# EAGLE design Temperature_GUN (EAGLE 7.7.0)

## Sheet 1 of 2
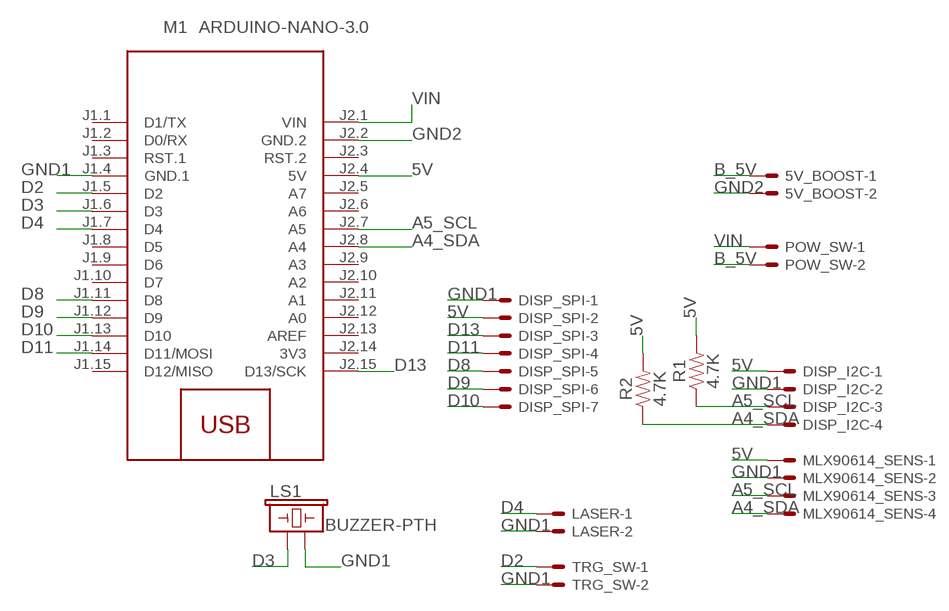
[diagram p0: schematic, sheet 1]

### Parts
5V_BOOST  JST-XH-02-PIN-ROUND-PAD  [JST-XH-02-PACKAGE-ROUND-PAD]
DISP_I2C  JST-XH-04-PIN-ROUND-PAD  [JST-XH-04-PACKAGE-ROUND-PAD]
DISP_SPI  JST-XH-07-PIN-ROUND-PAD  [JST-XH-07-PACKAGE-ROUND-PAD]
LASER  JST-XH-02-PIN-ROUND-PAD  [JST-XH-02-PACKAGE-ROUND-PAD]
LS1  BUZZER-PTH  [BUZZER-12MM]
M1  ARDUINO-NANO-3.0  [ARDUINO-NANO-3.0]
MLX90614_SENS  JST-XH-04-PIN-ROUND-PAD  [JST-XH-04-PACKAGE-ROUND-PAD]
POW_SW  JST-XH-02-PIN-ROUND-PAD  [JST-XH-02-PACKAGE-ROUND-PAD]
R1  4.7K  1KOHM-HORIZ-1/4W-1%  [AXIAL-0.3]
R2  4.7K  1KOHM-HORIZ-1/4W-1%  [AXIAL-0.3]
TRG_SW  JST-XH-02-PIN-ROUND-PAD  [JST-XH-02-PACKAGE-ROUND-PAD]

### Nets
5V: DISP_I2C.1 DISP_SPI.2 M1.J2.4(5V) MLX90614_SENS.1 R1.P$2 R2.P$2
A4_SDA: DISP_I2C.4 M1.J2.8(A4) MLX90614_SENS.4 R2.P$1
A5_SCL: DISP_I2C.3 M1.J2.7(A5) MLX90614_SENS.3 R1.P$1
B_5V: 5V_BOOST.1 POW_SW.2
D2: M1.J1.5(D2) TRG_SW.1
D3: LS1.+ M1.J1.6(D3)
D4: LASER.1 M1.J1.7(D4)
D8: DISP_SPI.5 M1.J1.11(D8)
D9: DISP_SPI.6 M1.J1.12(D9)
D10: DISP_SPI.7 M1.J1.13(D10)
D11: DISP_SPI.4 M1.J1.14(D11/MOSI)
D13: DISP_SPI.3 M1.J2.15(D13/SCK)
GND1: DISP_I2C.2 DISP_SPI.1 LASER.2 LS1.- M1.J1.4(GND.1) MLX90614_SENS.2 TRG_SW.2
GND2: 5V_BOOST.2 M1.J2.2(GND.2)
VIN: M1.J2.1(VIN) POW_SW.1
Unconnected: M1.J1.1(D1/TX) M1.J1.2(D0/RX) M1.J1.3(RST.1) M1.J1.8(D5) M1.J1.9(D6) M1.J1.10(D7) M1.J1.15(D12/MISO) M1.J2.3(RST.2) M1.J2.5(A7) M1.J2.6(A6) M1.J2.9(A3) M1.J2.10(A2) M1.J2.11(A1) M1.J2.12(A0) M1.J2.13(AREF)

## Sheet 2 of 2

## Power pins joined to a net without a drawn wire
3V3: M1.J2.14(3V3)

## Library data of the parts
5V_BOOST LASER POW_SW TRG_SW = Rembrandt Electronics - JST XH Connectors v1-0:JST-XH-02-PIN: JST XH Connector 2 Pin Wire to board connector. Pitch: 2,54 mm, (0.100") Number of pins: 2 Created by Rembrandt Electronics www.rembrandtelectronics.com
DISP_I2C MLX90614_SENS = Rembrandt Electronics - JST XH Connectors v1-0:JST-XH-04-PIN: JST XH Connector 2 Pin Wire to board connector. Pitch: 2,54 mm, (0.100") Number of pins: 4 Created by Rembrandt Electronics www.rembrandtelectronics.com
DISP_SPI = Rembrandt Electronics - JST XH Connectors v1-0:JST-XH-07-PIN: JST XH Connector 2 Pin Wire to board connector. Pitch: 2,54 mm, (0.100") Number of pins: 7 Created by Rembrandt Electronics www.rembrandtelectronics.com
LS1 = SparkFun-Electromechanical:BUZZER: Buzzer Small round buzzers that operate around the audible 2kHz range. You can use these as speakers to create simple music or user interfaces. Variant Overview: PTH - Mini Speaker - PC Mount 12mm 2.048kHz <https://www.sparkfun.com/products/7950> PTH_KIT - Mini Speaker - PC Mount 12mm 2.048kHz <https://www.sparkfun.com/products/7950> KIT simplifies soldering by adding stop mask to one side of the pads. PTH_NO_SILK - Mini Speaker - PC Mount 12mm 2.048kHz <https://www.sparkfun.com/products/7950> No silkscreen indicator of buzzer outline. PTH_KIT_NO_SILK - Mini Speaker - PC Mount 12mm 2.048kHz <https://www.sparkfun.com/products/7950> KIT package w/o silkscreen SMD - Buzzer Audio Magnetic (CCV-084B16) SMD buzzer used on, e.g. the LilyPad Buzzer <https://www.sparkfun.com/products/8463> and RFID USB Reader <https://www.sparkfun.com/products/9963>. SMD_KIT - Buzzer Audio Magnetic (CCV-084B16) SMD Buzzer with elongated pins to make soldering easier. Used on the SparkFun Simon Says - Surface Mount Soldering Kit <https://www.sparkfun.com/products/10935>.; PROD_ID: COMP-08253; SF_SKU: COM-07950
M1 = diy-modules:ARDUINO-NANO-3.0: Arduino Nano 3.0 and compatible devices More details available here: https://www.arduino.cc/en/Main/ArduinoBoardNano Click here to find device on ebay.com <http://www.ebay.com/sch/arduino+nano>
R1 R2 = SparkFun-Resistors:1KOHM: 1kΩ resistor A resistor is a passive two-terminal electrical component that implements electrical resistance as a circuit element. Resistors act to reduce current flow, and, at the same time, act to lower voltage levels within circuits. - Wikipedia; PROD_ID: RES-12182; VALUE: 1k

## Board
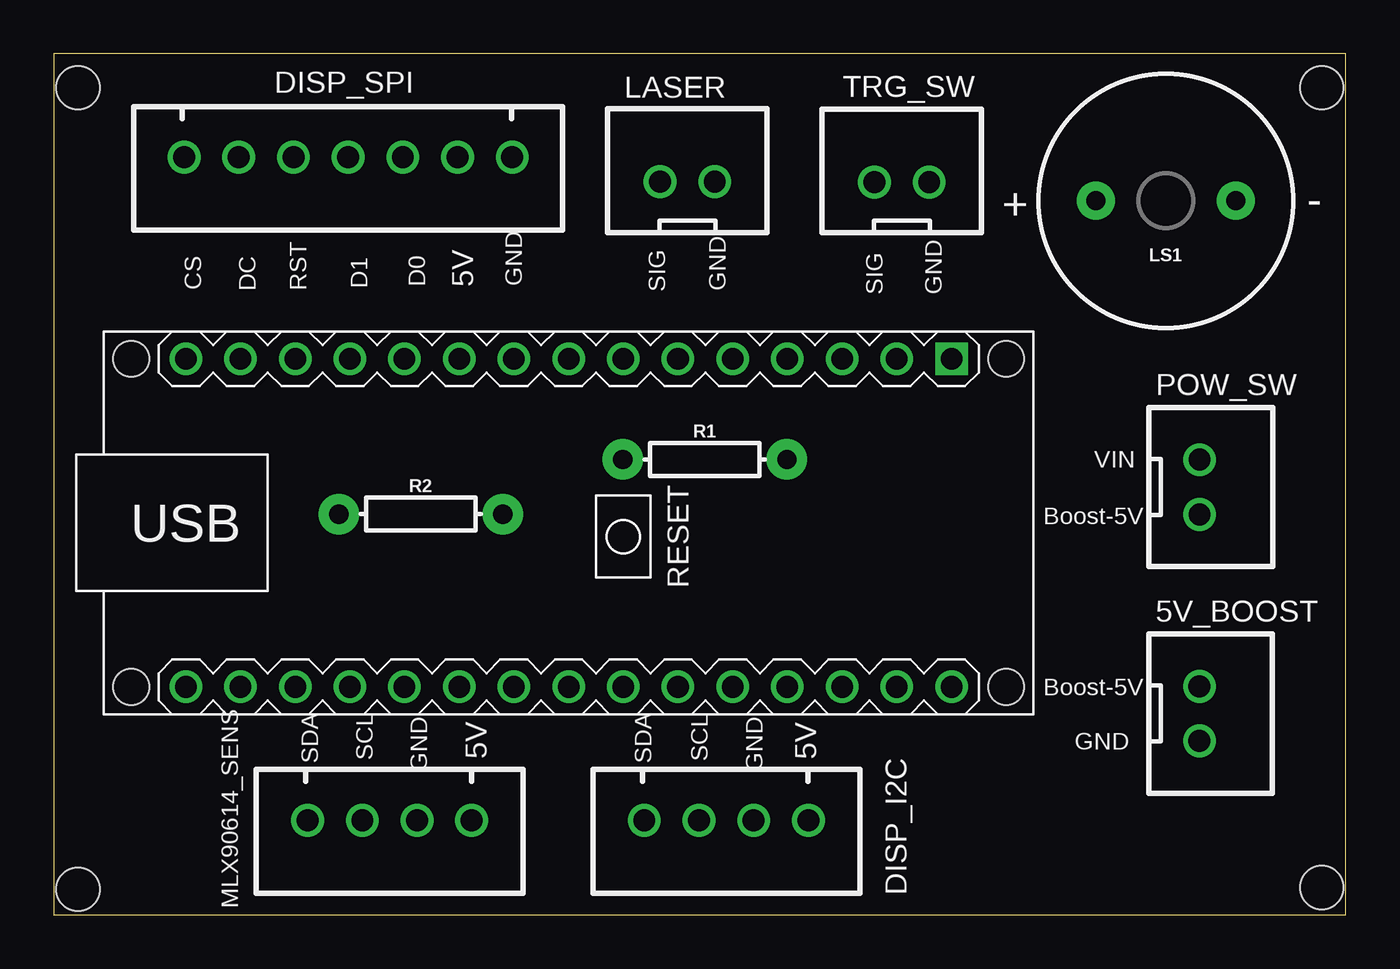
[diagram p1: board, top side]
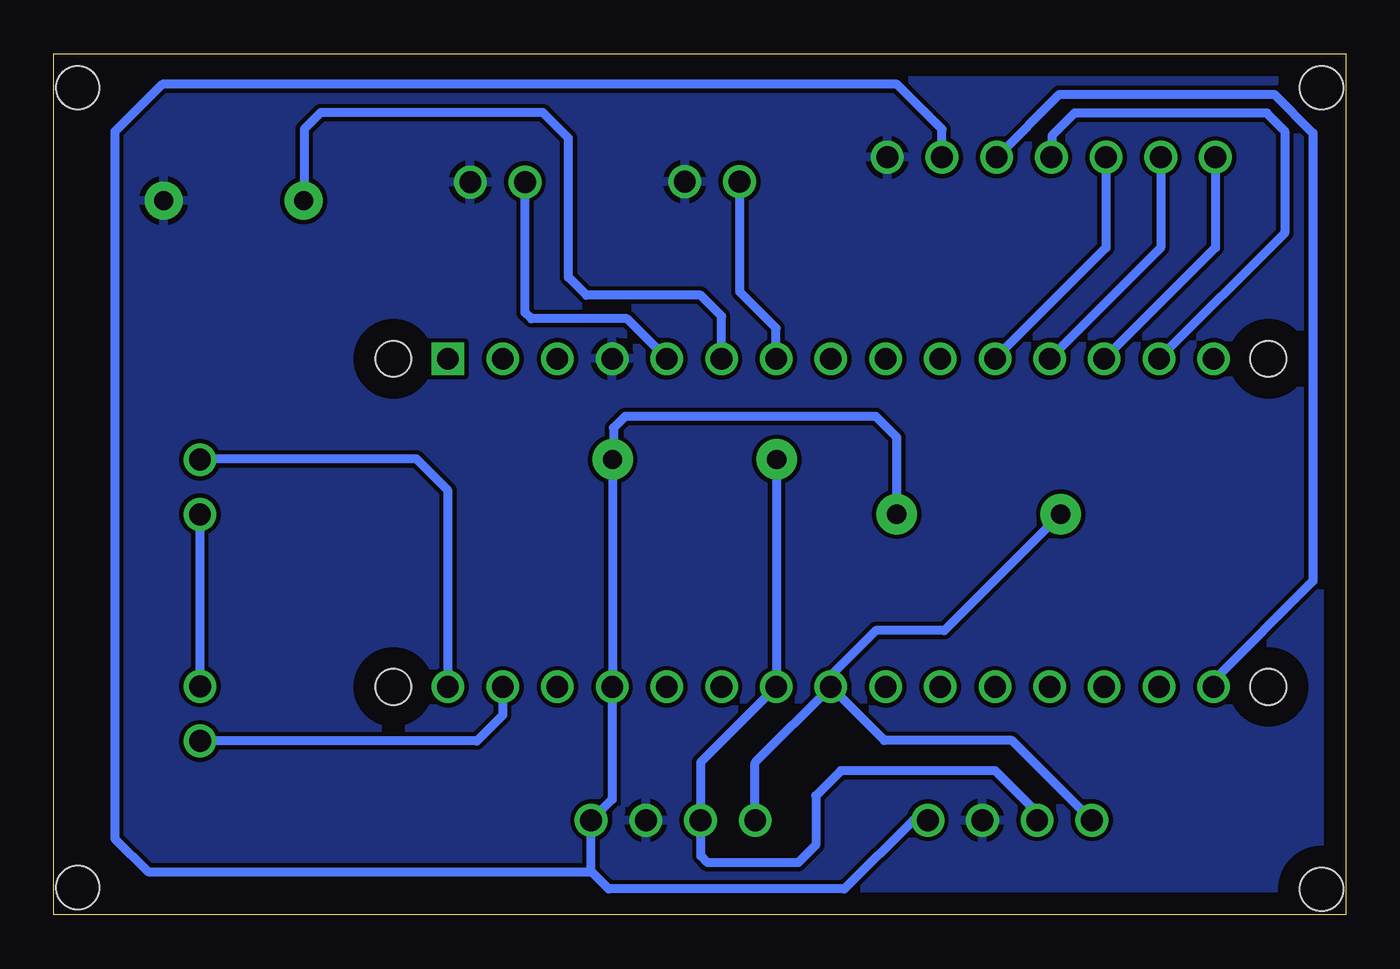
[diagram p2: board, bottom side, seen from below]

Size 60 x 40 mm. Coordinates in mm from the lower left corner, seen from the top.
Outline: 0,0 60,0 60,40 0,40 0,0
Copper layers (1*16): Top 0.035mm / dielectric 1.5mm / Bottom 0.035mm
Design rules "default": minimum track width 10mil, minimum drill 24mil, track to track 8mil, track to pad 8mil, pad to pad 8mil, via to via 8mil, smd to smd 8mil, copper to edge 40mil, drill to drill 8mil, minimum pad ring 10mil, minimum via ring 8mil, stop-mask expansion 4mil, vias tented up to drill 0mil, thermal gap 10mil
Holes 2 mm at 58.89,1.27 58.89,38.43 1.12,1.19 1.12,38.43

### Footprints (pad centres in the part's own frame; a part is rotated, then mirrored left to right if it is on the bottom)
JST-XH-02-PACKAGE-ROUND-PAD = drill 1.016: 1 -1.27,0; 2 1.27,0
JST-XH-04-PACKAGE-ROUND-PAD = drill 1.016: 1 -3.81,0; 2 -1.27,0; 3 1.27,0; 4 3.81,0
JST-XH-07-PACKAGE-ROUND-PAD = drill 1.016: 1 -7.62,0; 2 -5.08,0; 3 -2.54,0; 4 0,0; 5 2.54,0; 6 5.08,0; 7 7.62,0
BUZZER-12MM = drill 0.9 pad 1.778: + 3.25,0; - -3.25,0
ARDUINO-NANO-3.0 = drill 1 square: J1.1 17.78,7.62 | drill 1: J1.2 15.24,7.62; J1.3 12.7,7.62; J1.4 10.16,7.62; J1.5 7.62,7.62; J1.6 5.08,7.62; J1.7 2.54,7.62; J1.8 0,7.62; J1.9 -2.54,7.62; J1.10 -5.08,7.62; J1.11 -7.62,7.62; J1.12 -10.16,7.62; J1.13 -12.7,7.62; J1.14 -15.24,7.62; J1.15 -17.78,7.62; J2.1 17.78,-7.62; J2.2 15.24,-7.62; J2.3 12.7,-7.62; J2.4 10.16,-7.62; J2.5 7.62,-7.62; J2.6 5.08,-7.62; J2.7 2.54,-7.62; J2.8 0,-7.62; J2.9 -2.54,-7.62; J2.10 -5.08,-7.62; J2.11 -7.62,-7.62; J2.12 -10.16,-7.62; J2.13 -12.7,-7.62; J2.14 -15.24,-7.62; J2.15 -17.78,-7.62 | hole 1.651: -20.32,7.62; -20.32,-7.62; 20.32,-7.62; 20.32,7.62
AXIAL-0.3 = drill 0.9 pad 1.88: P$1 -3.81,0; P$2 3.81,0

### Placement (x,y rotation side)
5V_BOOST  53.21,9.35 270 top
DISP_I2C  31.23,4.39 180 top
DISP_SPI  13.67,35.19 180 top
LASER  29.43,34.06 0 top
LS1  51.65,33.18 180 top
M1  23.91,18.21 0 top
MLX90614_SENS  15.6,4.4 180 top
POW_SW  53.22,19.88 270 top
R1  30.24,21.16 0 top
R2  17.04,18.62 0 top
TRG_SW  39.39,34.04 0 top

### Tracks (layer width: path | path; a pad name or v marks a point on that pad's centre or on a via)
5V
  Bottom 0.406: MLX90614_SENS.1 20.09,4.4 23.28,1.2 34.23,1.2 35.05,2.02 | 35.05,2.02 DISP_I2C.1 34.07,5.37 M1.J2.4 34.05,10.61 R1.P$2 34.01,21.2 34.01,22.62 33.47,23.16 21.83,23.16 20.85,22.19 R2.P$2 | 35.05,2.02 35.07,2 55.62,2 57.16,3.54 57.16,36.39 54.96,38.58 20.84,38.58 18.75,36.49 DISP_SPI.2
A4_SDA
  Bottom 0.406: MLX90614_SENS.4 15.49,8.1 21.43,8.1 M1.J2.8 | R2.P$1 18.64,13.21 21.82,13.21 23.91,11.12 M1.J2.8 | DISP_I2C.4 27.42,7.08 M1.J2.8
A5_SCL
  Bottom 0.406: DISP_I2C.3 29.96,7.08 M1.J2.7 26.43,10.61 R1.P$1 | 29.96,3.92 DISP_I2C.3 | MLX90614_SENS.3 14.33,4.75 16.28,6.7 23.45,6.7 24.61,5.53 24.61,3.25 25.44,2.43 29.63,2.43 29.95,2.74 29.95,4.38 DISP_I2C.3
B_5V
  Bottom 0.406: POW_SW.2 5V_BOOST.1
D2
  Bottom 0.406: M1.J1.5 33.38,27.7 37.82,27.7 38.12,27.99 TRG_SW.1
D3
  Bottom 0.406: M1.J1.6 28.99,27.82 29.95,28.78 35.27,28.78 36.1,29.62 36.1,36.09 37.28,37.27 47.6,37.27 48.37,36.5 48.37,33.2 LS1.+
D4
  Bottom 0.406: M1.J1.7 26.45,27.25 28.13,28.93 28.13,34.04 LASER.1
D8
  Bottom 0.406: DISP_SPI.5 11.13,30.99 M1.J1.11
D9
  Bottom 0.406: DISP_SPI.6 8.59,30.99 M1.J1.12
D10
  Bottom 0.406: DISP_SPI.7 6.05,30.99 M1.J1.13
D11
  Bottom 0.406: M1.J1.14 2.83,31.67 2.83,36.41 3.66,37.24 12.6,37.24 13.64,36.2 13.64,35.22 DISP_SPI.4
D13
  Bottom 0.406: M1.J2.15 6.13,10.9 1.52,15.51 1.52,36.31 3.32,38.12 13.29,38.12 DISP_SPI.3
GND1
  pour Bottom: 59.44,39.5 59.44,0.45 0.36,0.45 0.89,39.23 0.89,39.5
GND2
  Bottom 0.406: M1.J2.2 39.15,9.27 40.35,8.08 5V_BOOST.2
VIN
  Bottom 0.406: M1.J2.1 41.69,19.71 43.15,21.18 53.18,21.18 POW_SW.1

### Text on the board
tNames: + | - | CS | DC | RST | D1 | D0 | 5V | GND | SIG | GND | SIG | GND | VIN | Boost-5V | Boost-5V | GND | GND | GND | SDA | SCL | 5V | SDA | SCL | 5V